# Altium project Ultrasound Smart Probe_Ver2.PrjPcb (part 6 of 9)

## Sheet LVPS FPGA.SchDoc: LVPS FPGA
size 431 x 279 mm; Date: Not shown in title block; ApprovedBy: Not shown in title block; CheckedBy: Not shown in title block; Author: Not shown in title block; CompanyName: Not shown in title block; DrawnBy: Abhishek Vishwa; Engineer: Not shown in title block; Organization: Not shown in title block; Address1: Not shown in title block; Address2: Not shown in title block; Address3: Not shown in title block; Address4: Not shown in title block; DocumentNumber: 1; Revision: Use project parameter SCH_Rev; SheetNumber: 7; SheetTotal: 12; PageSetup: Record=PageOptions|CenterHorizontal=True|CenterVertical=True|PrintScale=1.00|XCorrection=1.00|YCorrection=1.00|PrintKind=0|BorderSize=5000000|LeftOffset=0|BottomOffset=0|Orientation=2|PaperLength=1000|PaperWidth=1000|Scale=100|PaperSource=15|PrintQuality=600|MediaType=1|DitherType=10|PaperKind=Letter|PrintScaleMode=1; CurrentTime: Not shown in title block; CurrentDate: Not shown in title block; Time: Not shown in title block; DocumentFullPathAndName: Not shown in title block; DocumentName: Not shown in title block; ModifiedDate: Not shown in title block; ImagePath: Not shown in title block
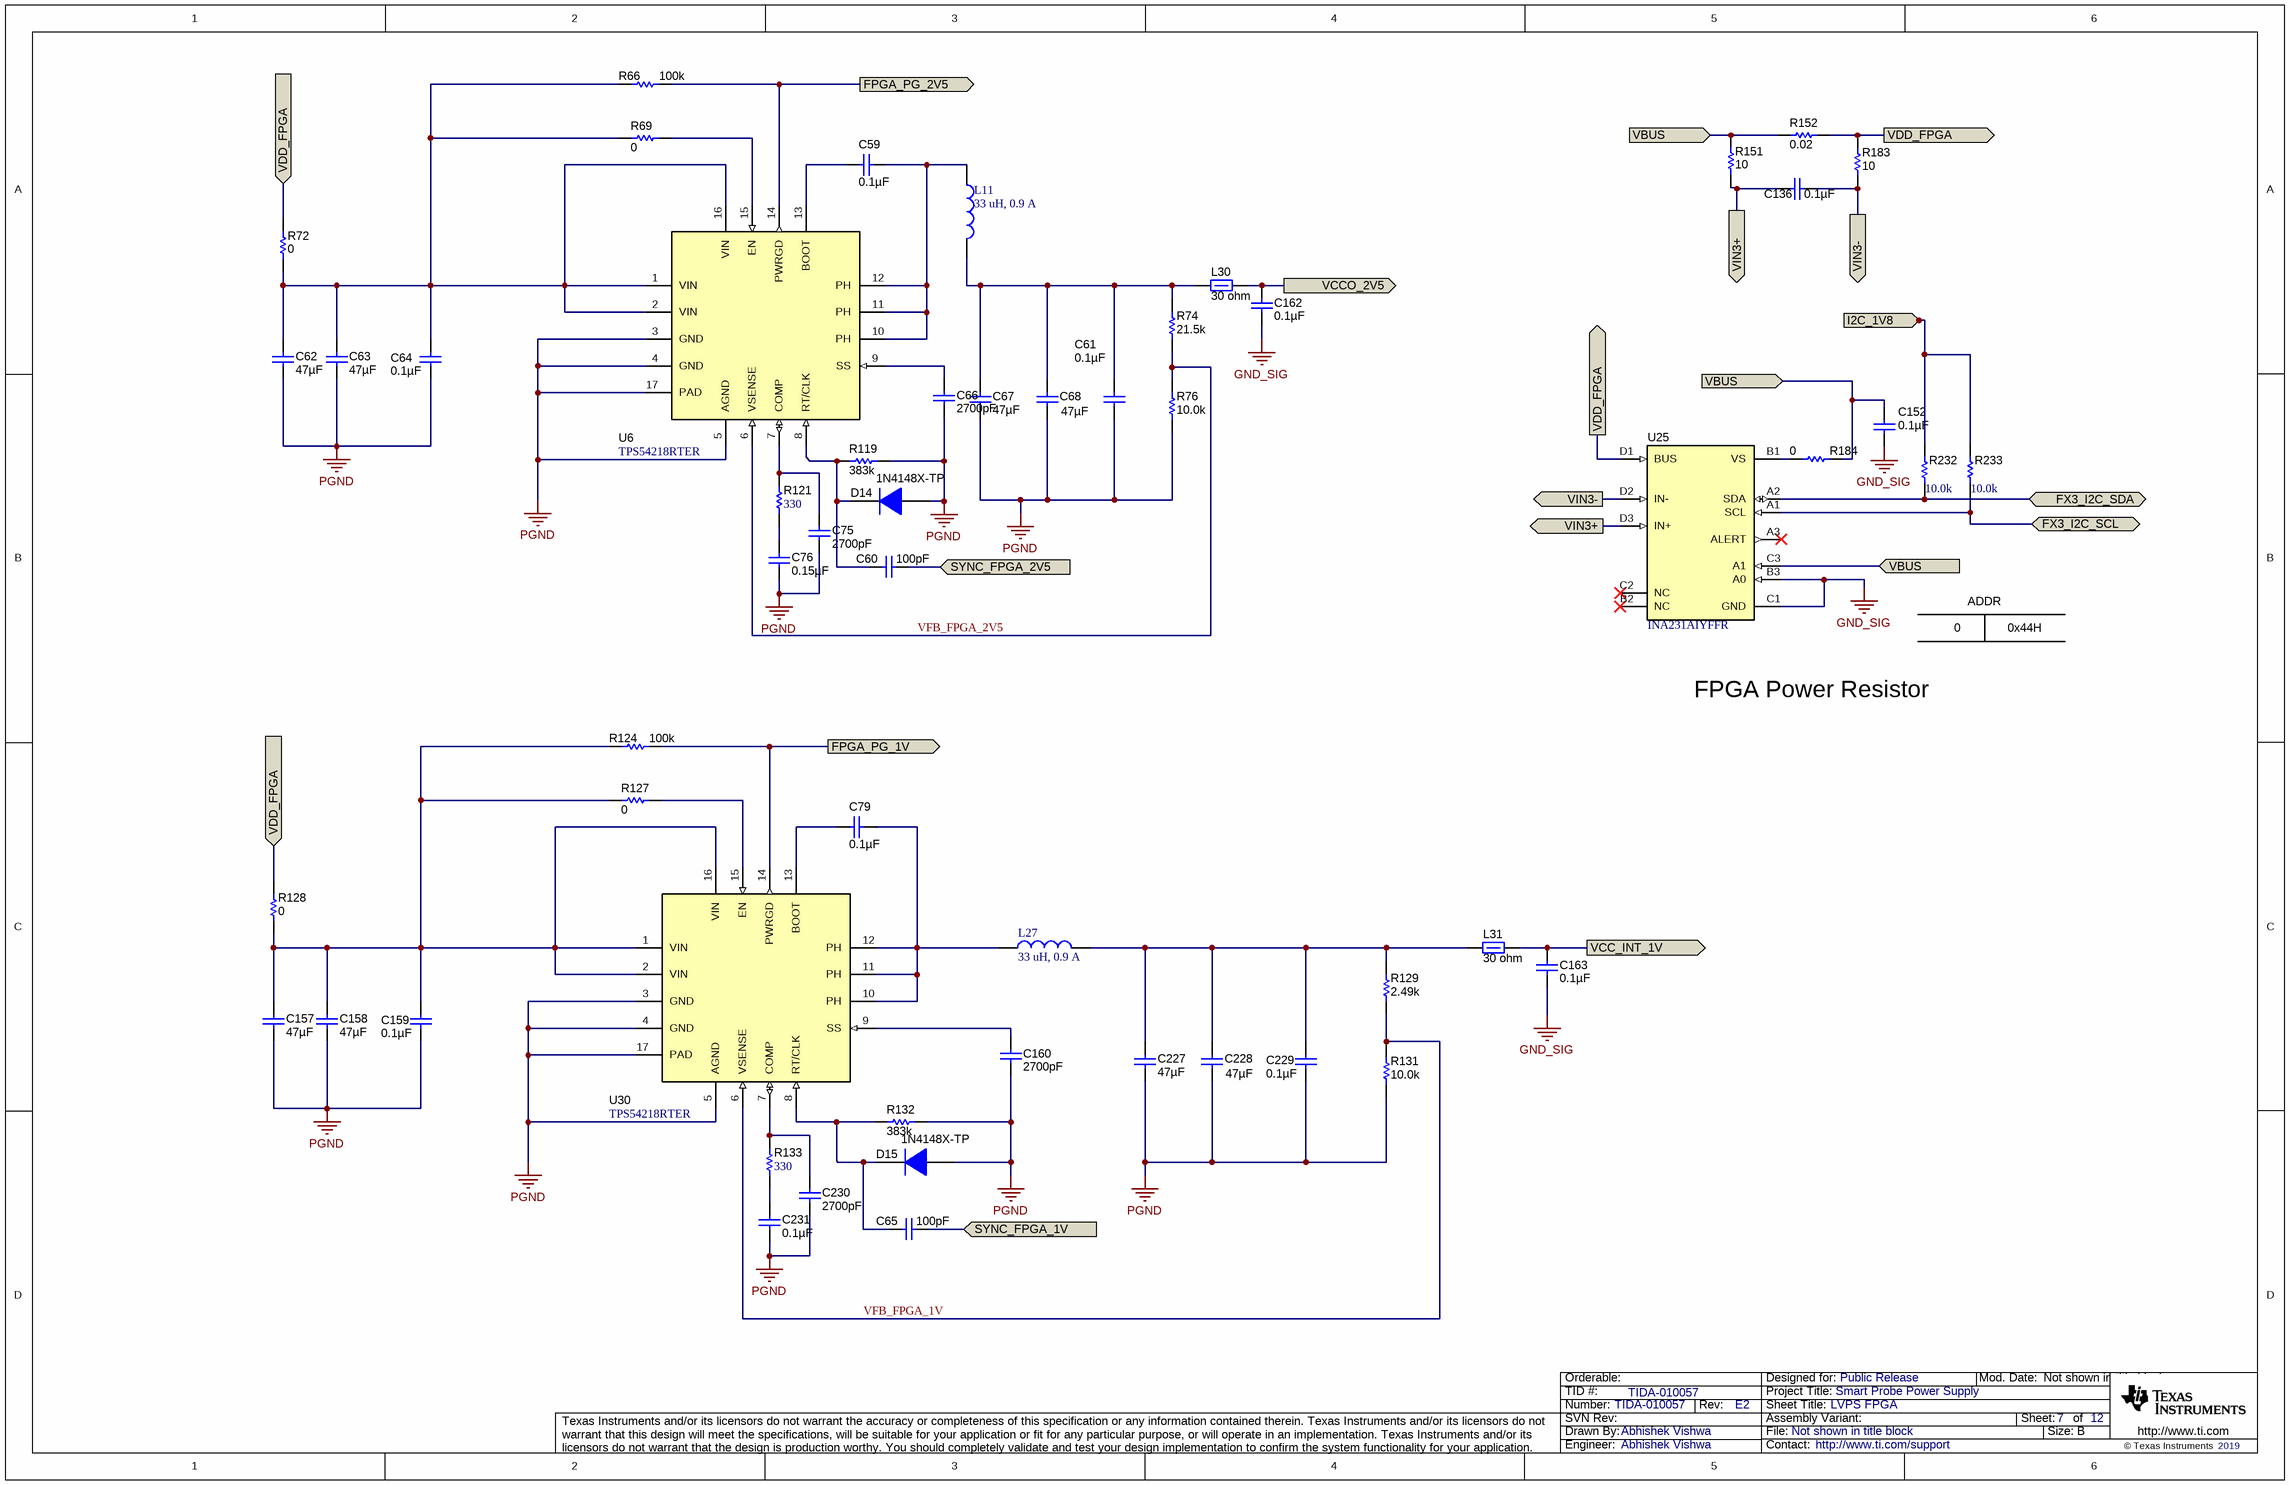
[diagram p6: LVPS FPGA.SchDoc]

### Parts
C59  ValueDisplayed: 0.1µF  [0603]  (hidden comment: 885012206095)
C60  ValueDisplayed: 100pF  [0402]  (hidden comment: CL05C101JB5NNNC)
C61  ValueDisplayed: 0.1µF  [0603]  (hidden comment: 885012206095)
C62  ValueDisplayed: 47µF  [0805_HV]  (hidden comment: GRM219R60J476ME44D)
C63  ValueDisplayed: 47µF  [0805_HV]  (hidden comment: GRM219R60J476ME44D)
C64  ValueDisplayed: 0.1µF  [0603]  (hidden comment: 885012206095)
C65  ValueDisplayed: 100pF  [0402]  (hidden comment: CL05C101JB5NNNC)
C66  ValueDisplayed: 2700pF  [0402]  (hidden comment: CL05B272KB5NNNC)
C67  ValueDisplayed: 47µF  [0603]  (hidden comment: GRM188R60J476ME15D)
C68  ValueDisplayed: 47µF  [0603]  (hidden comment: GRM188R60J476ME15D)
C75  ValueDisplayed: 2700pF  [0402]  (hidden comment: CL05B272KB5NNNC)
C76  ValueDisplayed: 0.15µF  [0402]  (hidden comment: CL05B154KO5NNNC)
C79  ValueDisplayed: 0.1µF  [0603]  (hidden comment: 885012206095)
C136  ValueDisplayed: 0.1µF  [0201_033]  (hidden comment: C0603X6S1C104K030BC)
C152  ValueDisplayed: 0.1µF  [0201_033]  (hidden comment: C0603X6S1C104K030BC)
C157  ValueDisplayed: 47µF  [0805_HV]  (hidden comment: GRM219R60J476ME44D)
C158  ValueDisplayed: 47µF  [0805_HV]  (hidden comment: GRM219R60J476ME44D)
C159  ValueDisplayed: 0.1µF  [0603]  (hidden comment: 885012206095)
C160  ValueDisplayed: 2700pF  [0402]  (hidden comment: CL05B272KB5NNNC)
C162  ValueDisplayed: 0.1µF  [0402]  (hidden comment: GRM155R61E104KA87D)
C163  ValueDisplayed: 0.1µF  [0402]  (hidden comment: GRM155R61E104KA87D)
C227  ValueDisplayed: 47µF  [0603]  (hidden comment: GRM188R60J476ME15D)
C228  ValueDisplayed: 47µF  [0603]  (hidden comment: GRM188R60J476ME15D)
C229  ValueDisplayed: 0.1µF  [0603]  (hidden comment: 885012206095)
C230  ValueDisplayed: 2700pF  [0402]  (hidden comment: CL05B272KB5NNNC)
C231  ValueDisplayed: 0.1µF  [0402]  (hidden comment: GRM155R61E104KA87D)
D14  1N4148X-TP  [SOD-523]
D15  1N4148X-TP  [SOD-523]
L11  33 uH, 0.9 A  [WE-TPC_5828]
L27  33 uH, 0.9 A  [WE-TPC_5828]
L30  ValueDisplayed: 30 ohm  [0603]  (hidden comment: 742792609)
L31  ValueDisplayed: 30 ohm  [0603]  (hidden comment: 742792609)
R66  ValueDisplayed: 100k  [0402]  (hidden comment: CRCW0402100KJNED)
R69  ValueDisplayed: 0  [0402]  (hidden comment: ERJ-2GE0R00X)
R72  ValueDisplayed: 0  [0603]  (hidden comment: RMCF0603ZT0R00)
R74  ValueDisplayed: 21.5k  [0402]  (hidden comment: ERJ-2RKF2152X)
R76  ValueDisplayed: 10.0k  [0402]  (hidden comment: ERA-2AEB103X)
R119  ValueDisplayed: 383k  [0402]  (hidden comment: CRCW0402383KFKED)
R121  ValueDisplayed: 330  [0402]  (hidden comment: CRCW0402160RJNED)
R124  ValueDisplayed: 100k  [0402]  (hidden comment: CRCW0402100KJNED)
R127  ValueDisplayed: 0  [0402]  (hidden comment: ERJ-2GE0R00X)
R128  ValueDisplayed: 0  [0603]  (hidden comment: RMCF0603ZT0R00)
R129  ValueDisplayed: 2.49k  [0402]  (hidden comment: ERJ-2RKF2491X)
R131  ValueDisplayed: 10.0k  [0402]  (hidden comment: ERA-2AEB103X)
R132  ValueDisplayed: 383k  [0402]  (hidden comment: CRCW0402383KFKED)
R133  ValueDisplayed: 330  [0402]  (hidden comment: CRCW0402160RJNED)
R151  ValueDisplayed: 10  [0201]  (hidden comment: RC0201JR-0710RL)
R152  ValueDisplayed: 0.02  [1206]  (hidden comment: CSR1206FK20L0)
R183  ValueDisplayed: 10  [0201]  (hidden comment: RC0201JR-0710RL)
R184  ValueDisplayed: 0  [0201]  (hidden comment: ERJ-1GN0R00C)
R232  ValueDisplayed: 10.0k  [0201]  (hidden comment: RC0201FS-7D10KL)
R233  ValueDisplayed: 10.0k  [0201]  (hidden comment: RC0201FS-7D10KL)
U6  TPS54218RTER  [RTE0016F]
U25  INA231AIYFFR  [YFF0012AKAD]
U30  TPS54218RTER  [RTE0016F]

### Ports
FPGA_PG_1V (out), FPGA_PG_2V5 (out), FX3_I2C_SCL (bidir), FX3_I2C_SDA (bidir), I2C_1V8 (in), SYNC_FPGA_1V (in), SYNC_FPGA_2V5 (in), VBUS (in), VCC_INT_1V (out), VCCO_2V5 (out), VDD_FPGA (in), VDD_FPGA (out), VIN3+ (out), VIN3- (out)

### Nets
GND_SIG: C152.2 C162.1 C163.1 U25.B3(A0) U25.C1(GND)
PGND: C61.2 C62.2 C63.2 C64.2 C66.2 C67.2 C68.2 C75.2 C76.1 C157.2 C158.2 C159.2 C160.2 C227.2 C228.2 C229.2 C230.2 C231.1 D14.2(A) D15.2(A) R76.1 R119.2 R131.1 R132.2 U6.3(GND) U6.4(GND) U6.5(AGND) U6.17(PAD) U30.3(GND) U30.4(GND) U30.5(AGND) U30.17(PAD)
FPGA_PG_1V: R124.2 U30.14(PWRGD) ; port FPGA_PG_1V
FPGA_PG_2V5: R66.2 U6.14(PWRGD) ; port FPGA_PG_2V5
FX3_I2C_SCL: R233.1 U25.A1(SCL) ; port FX3_I2C_SCL
FX3_I2C_SDA: R232.1 U25.A2(SDA) ; port FX3_I2C_SDA
I2C_1V8: R232.2 R233.2 ; port I2C_1V8
SYNC_FPGA_1V: C65.1 ; port SYNC_FPGA_1V
SYNC_FPGA_2V5: C60.1 ; port SYNC_FPGA_2V5
VBUS: C152.1 R151.2 R152.1 R184.2 U25.C3(A1) ; port VBUS
VCC_INT_1V: C163.2 L31.1 ; port VCC_INT_1V
VCCO_2V5: C162.2 L30.1 ; port VCCO_2V5
VDD_FPGA: R72.2 R128.2 R152.2 R183.2 U25.D1(BUS) ; port VDD_FPGA
VFB_FPGA_1V: R129.1 R131.2 U30.6(VSENSE)
VFB_FPGA_2V5: R74.1 R76.2 U6.6(VSENSE)
VIN3+: C136.1 R151.1 U25.D3(IN+) ; port VIN3+
VIN3-: C136.2 R183.1 U25.D2(IN-) ; port VIN3-
NetC59_1: C59.1 U6.13(BOOT)
NetC59_2: C59.2 L11.1 U6.10(PH) U6.11(PH) U6.12(PH)
NetC60_2: C60.2 D14.1(K) R119.1 U6.8(RT/CLK)
NetC61_1: C61.1 C67.1 C68.1 L11.2 L30.2 R74.2
NetC62_1: C62.1 C63.1 C64.1 R66.1 R69.1 R72.1 U6.1(VIN) U6.2(VIN) U6.16(VIN)
NetC65_2: C65.2 D15.1(K) R132.1 U30.8(RT/CLK)
NetC66_1: C66.1 U6.9(SS)
NetC75_1: C75.1 R121.2 U6.7(COMP)
NetC76_2: C76.2 R121.1
NetC79_1: C79.1 U30.13(BOOT)
NetC79_2: C79.2 L27.1 U30.10(PH) U30.11(PH) U30.12(PH)
NetC157_1: C157.1 C158.1 C159.1 R124.1 R127.1 R128.1 U30.1(VIN) U30.2(VIN) U30.16(VIN)
NetC160_1: C160.1 U30.9(SS)
NetC227_1: C227.1 C228.1 C229.1 L27.2 L31.2 R129.2
NetC230_1: C230.1 R133.2 U30.7(COMP)
NetC231_2: C231.2 R133.1
NetR69_2: R69.2 U6.15(EN)
NetR127_2: R127.2 U30.15(EN)
NetR184_1: R184.1 U25.B1(VS)

Not connected (* = marked no-connect by the designer): U25 A3(ALERT)* B2(NC)* C2(NC)*

### Notes on the sheet
- 0
- ADDR
- 0x44H
- FPGA Power Resistor
- Drawn By:
- SVN Rev:
- Number:
- TID #:
- Orderable:
- Rev:
- Sheet Title:
- File:
- Project Title:
- Designed for:
- Assembly Variant:
- Mod. Date:
- Sheet:
- Size:
- of
- B
- http://www.ti.com
- Texas Instruments and/or its licensors do not warrant the accuracy or completeness of this specification or any information contained therein. Texas Instruments and/or its licensors do not warrant that this design will meet the specifications, will be suitable for your application or fit for any particular purpose, or will operate in an implementation. Texas Instruments and/or its licensors do not warrant that the design is production worthy. You should completely validate and test your design implementation to confirm the system functionality for your application.
- Engineer:
- Contact:
- © Texas Instruments

### Library data of the parts
C59 C61 C64 C79 C159 C229 = 885012206095: CAP, CERM, 0.1 µF, 50 V,+/- 10%, X7R, 0603; Manufacturer: Wurth Elektronik; Polarized: N; CompType: Capacitor; Value: 0.1uF; U/M: EA; Cap_F: 0.0000001; Tolerance_%: 10; VDC_V: 50; Value2: 50V; TaMin_C: -55; TaMax_C: 125; SizeArea_mm2: 1.28; SizeAreaWB_mm2: 4.68; SizeX_mm: 1.6; SizeY_mm: 0.8; SizeZ_mm: 1; AEC Category: Q200; Green_Lifecycle: Active; Green_REACh: Passed; SymbolVersion: 2008-07-09; PartNumber: 885012206095; PackageReference: 0603; RoHS: Y; MountType: SMT; Technology: Ceramic; TempCo: X7R; Cap_Case: 0603; Published: 2008-06-19; Publisher: Texas Instruments; LatestRevisionDate: 2017-06-22; ComponentLink1Description: Datasheet link; ComponentLink1URL: http://katalog.we-online.de/pbs/datasheet/885012206095.pdf; AEC Qualified: N; AEC Grade: N/A; Green_EU RoHS: Passed; Green_EU RoHS-2: Incomplete
C60 C65 = 0402YC101KAT2A: CAP CER 100PF 50V C0G/NP0 0402; Manufacturer: Samsung Electro-Mechanics; Polarized: N; CompType: Capacitor; U/M: EA; Cap_F: 0.0000000001; Tolerance_%: 5; VDC_V: 16; Value2: 50; TempCo: X7R; TaMin_C: -55; TaMax_C: 125; SizeArea_mm2: 0.5; SizeAreaWB_mm2: 3; SizeX_mm: 1; SizeZ_mm: 0.6; AEC Category: Q200; SymbolVersion: 2008-07-09; Value: 100pF; PartNumber: CL05C101JB5NNNC; PackageReference: 0402; RoHS: Y; MountType: SMT; Technology: Ceramic; Cap_Case: 0402; SizeY_mm: 0.5; Published: 2008-06-19; Publisher: Texas Instruments; LatestRevisionDate: 2017-06-22; ComponentLink1Description: Datasheet link; ComponentLink1URL: http://datasheets.avx.com/X7RDielectric.pdf; Supplier 1: Digi-Key; Supplier Part Number 1: 1276-1025-1-ND; Supplier 2: Newark; Supplier 3: Mouser; AEC Qualified: N; AEC Grade: N/A
C62 C63 C157 C158 = GRM219R60J476ME44D: CAP, CERM, 47 µF, 6.3 V,+/- 20%, X5R, 0805; Manufacturer: MuRata; Polarized: N; CompType: Capacitor; Value: 47uF; U/M: EA; Cap_F: 0.000047; Tolerance_%: 20; VDC_V: 6.3; Value2: 6.3V; TaMin_C: -55; TaMax_C: 85; Cap_Case: 0805; SizeArea_mm2: 2.5; SizeAreaWB_mm2: 6.75; SizeX_mm: 2; SizeY_mm: 1.25; SizeZ_mm: 1.45; AEC Category: Q200; Green_Lifecycle: Active; Green_REACh: Passed; SymbolVersion: 2008-07-09; PartNumber: GRM219R60J476ME44D; PackageReference: 0805; RoHS: Y; MountType: SMT; Technology: Ceramic; TempCo: X5R; Published: 2008-06-19; Publisher: Texas Instruments; LatestRevisionDate: 2017-06-22; ComponentLink1Description: Datasheet link; ComponentLink1URL: http://psearch.en.murata.com/capacitor/product/GRM219R60J476ME44%23.pdf; Supplier 1: Digi-Key; Supplier Part Number 1: 490-13249-1-ND; Supplier 2: Mouser; Supplier Part Number 2: 81-GRM219R60J476ME4D; AEC Qualified: N; AEC Grade: N/A; Green_EU RoHS: Passed; Green_EU RoHS-2: Incomplete
C66 C75 C160 C230 = GRM155R71H272KA01D: CAP, CERM, 2700 pF, 50 V,+/- 10%, X7R, 0402; Manufacturer: Samsung Electro-Mechanics; Polarized: N; CompType: Capacitor; Value: 2700pF; U/M: EA; Cap_F: 0.0000000027; Tolerance_%: 10; VDC_V: 50; Value2: 50V; TaMin_C: -55; TaMax_C: 125; SizeArea_mm2: 0.5; SizeAreaWB_mm2: 3; SizeX_mm: 1; SizeZ_mm: 0.6; AEC Category: Q200; SymbolVersion: 2008-07-09; PartNumber: CL05B272KB5NNNC; PackageReference: 0402; RoHS: Y; MountType: SMT; Technology: Ceramic; TempCo: X7R; Cap_Case: 0402; SizeY_mm: 0.5; Published: 2008-06-19; Publisher: Texas Instruments; LatestRevisionDate: 2017-06-22; ComponentLink1Description: Datasheet link; ComponentLink1URL: http://search.murata.co.jp/Ceramy/PnsearchViewAction.do?HnOFG=ON&HnNFG=ON&SEL_CNT=50&sLang=en&sKey=GRM155R71H272KA01D&x=9&y=9&search=startwith; Supplier 1: Digi-Key; Supplier Part Number 1: 1276-1268-1-ND; Supplier 2: Mouser; AEC Qualified: ?
C67 C68 C227 C228 = GRM188R60J476ME15D: CAP, CERM, 47 µF, 6.3 V,+/- 20%, X5R, 0603; Manufacturer: MuRata; Polarized: N; CompType: Capacitor; Value: 47uF; U/M: EA; Cap_F: 0.000047; Tolerance_%: 20; VDC_V: 6.3; Value2: 6.3V; TaMin_C: -55; TaMax_C: 85; SizeArea_mm2: 1.28; SizeAreaWB_mm2: 4.68; SizeX_mm: 1.6; SizeY_mm: 0.8; SizeZ_mm: 1; AEC Category: Q200; Green_Lifecycle: Active; Green_REACh: Passed; SymbolVersion: 2008-07-09; PartNumber: GRM188R60J476ME15D; PackageReference: 0603; RoHS: Y; MountType: SMT; Technology: Ceramic; TempCo: X5R; Cap_Case: 0603; Published: 2008-06-19; Publisher: Texas Instruments; LatestRevisionDate: 2017-06-22; ComponentLink1Description: Datasheet link; ComponentLink1URL: http://psearch.en.murata.com/capacitor/product/GRM188R60J476ME15%23.pdf; AEC Qualified: ?; Green_EU RoHS: Passed; Green_EU RoHS-2: Incomplete
C76 = GRM155R61E104KA87D: CAP CER 0.15UF 16V X7R 0402; Manufacturer: Samsung Electro-Mechanics; Polarized: N; CompType: Capacitor; U/M: EA; Cap_F: 0.00000015; Tolerance_%: 10; VDC_V: 25; TempCo: X5R; TaMin_C: -55; TaMax_C: 85; SizeArea_mm2: 0.5; SizeAreaWB_mm2: 3; SizeX_mm: 1; SizeZ_mm: 0.6; Green_Lifecycle: Active; Green_REACh: Passed; SymbolVersion: 2008-07-09; Value: 0.15uF; PartNumber: CL05B154KO5NNNC; PackageReference: 0402; RoHS: Y; Value2: 16V; MountType: SMT; Technology: Ceramic; Cap_Case: 0402; SizeY_mm: 0.5; Published: 2008-06-19; Publisher: Texas Instruments; LatestRevisionDate: 2017-06-22; ComponentLink1Description: Datasheet link; ComponentLink1URL: http://psearch.murata.com/capacitor/product/GRM155R61E104KA87%23.pdf; AEC Qualified: N; AEC Grade: N/A; Green_EU RoHS: Passed; Green_EU RoHS-2: Passed
C136 C152 = C0603X6S1C104K030BC: CAP, CERM, 0.1 µF, 16 V,+/- 10%, X6S, 0201; Manufacturer: TDK; Polarized: N; CompType: Capacitor; Value: 0.1uF; U/M: EA; Cap_F: 0.0000001; Tolerance_%: 10; VDC_V: 16; Value2: 16V; TaMin_C: -55; TaMax_C: 105; Cap_Case: 0201; SizeArea_mm2: 0.18; SizeAreaWB_mm2: 2.08; SizeX_mm: 0.6; SizeY_mm: 0.3; SizeZ_mm: 0.33; AEC Category: Q200; SymbolVersion: 2008-07-09; PartNumber: C0603X6S1C104K030BC; PackageReference: 0201; RoHS: Y; MountType: SMT; Technology: Ceramic; TempCo: X6S; Published: 2008-06-19; Publisher: Texas Instruments; LatestRevisionDate: 2017-06-22; ComponentLink1Description: Datasheet link; ComponentLink1URL: http://product.tdk.com/en/catalog/datasheets/mlcc_commercial_general_en.pdf; Supplier 1: Digi-Key; Supplier Part Number 1: 445-15903-1-ND; Supplier 2: Newark; Supplier Part Number 2: 17X8592; Supplier 3: Mouser; Supplier Part Number 3: 810-C0603X6S1C104KBC; AEC Qualified: N; AEC Grade: N/A
C162 C163 C231 = GRM155R61E104KA87D: CAP, CERM, 0.1 µF, 25 V,+/- 10%, X5R, 0402; Manufacturer: MuRata; Polarized: N; CompType: Capacitor; Value: 0.1uF; U/M: EA; Cap_F: 0.0000001; Tolerance_%: 10; VDC_V: 25; Value2: 25V; TaMin_C: -55; TaMax_C: 85; SizeArea_mm2: 0.5; SizeAreaWB_mm2: 3; SizeX_mm: 1; SizeZ_mm: 0.6; AEC Category: Q200; Green_Lifecycle: Active; Green_REACh: Passed; SymbolVersion: 2008-07-09; PartNumber: GRM155R61E104KA87D; PackageReference: 0402; RoHS: Y; MountType: SMT; Technology: Ceramic; TempCo: X5R; Cap_Case: 0402; SizeY_mm: 0.5; Published: 2008-06-19; Publisher: Texas Instruments; LatestRevisionDate: 2017-06-22; ComponentLink1Description: Datasheet link; ComponentLink1URL: http://psearch.murata.com/capacitor/product/GRM155R61E104KA87%23.pdf; Supplier 1: Digi-Key; Supplier Part Number 1: 490-5920-1-ND; Supplier 2: Mouser; Supplier Part Number 2: 81-GRM155R61E104KA7D; AEC Qualified: N; AEC Grade: N/A; Green_EU RoHS: Passed; Green_EU RoHS-2: Passed
D14 D15 = 1N4148X-TP: Diode, Switching, 75 V, 0.3 A, SOD-523; Manufacturer: Micro Commercial Components; U/M: EA; Vf_V: 1.25; Value: 75V; Value1: 0.3A; Value2: 1.25V; Io_A: 0.3; Vr_V: 75; TJmax_C: 150; SizeAreaWB_mm2: 5.13; SizeArea_mm2: 1.53; SizeX_mm: 1.7; SizeY_mm: 0.9; SizeZ_mm: 0.65; AEC Category: Q101; Green_Lifecycle: Not Set; Green_REACh: Incomplete; SymbolVersion: 2008-12-08; PartNumber: 1N4148X-TP; PackageReference: SOD-523; CompType: Diode; MountType: SMT; Type: Switching; RoHS: Y; Published: 2008-06-26; Publisher: Texas Instruments; LatestRevisionDate: 2017-06-26; ComponentLink1Description: Datasheet link; ComponentLink1URL: http://www.mccsemi.com/up_pdf/1N4148X(SOD-523).PDF; Supplier 1: Digi-Key; Supplier Part Number 1: 1N4148XTPMSCT-ND; Supplier 2: Newark; Supplier Part Number 2: 69R6666; Supplier 3: Mouser; Supplier Part Number 3: 833-1N4148X-TP; AEC Qualified: ?; Green_EU RoHS: Incomplete; Green_EU RoHS-2: Incomplete
L11 L27 = 744053330: SMT Shielded Tiny Power Inductor WE-TPC, size 5828, 33 uH, 0.9 A; Rated Current: 0.9 A; Inductance: 33 uH; DC Resistance max.: 190 mOhm; Self Resonant Frequency: 15 MHz; Saturation Current: 0.75 A; ComponentLink1Description: Manufacturer; ComponentLink1URL: http://www.we-online.de; ComponentLink2Description: Datasheet; ComponentLink2URL: https://katalog.we-online.com/pbs/datasheet/744053330.pdf; Part Number: 744053330; Published Date: December 2018; Publisher: Wurth Elektronik; Size: 5828; Operating Temperature: -40 to +125 degC; Mounting Technology: SMT; Packaging: Tape and Reel
L30 L31 = 742792609: Ferrite Bead, 30 ohm @ 100 MHz, 3 A, 0603; Manufacturer: Wurth Elektronik; Value: 30 ohm; Imax_A: 3; DCR_ohm: 0.04; Value1: 0.04 ohm; Value2: 3A; SizeAreaWB_mm2: 4.68; SizeArea_mm2: 1.28; SizeX_mm: 1.6; SizeY_mm: 0.8; SizeZ_mm: 1; ZTyp@100MHz_Ohm: 30; Ztyp@1GHz_Ohm: 40.472; Green_Lifecycle: Active; Green_REACh: Passed; SymbolVersion: 2017-01-06; PartNumber: 742792609; CompType: Ferrite Bead; MountType: SMT; PackageReference: 0603; Published: 2014-04-30; Publisher: Texas Instruments; LatestRevisionDate: 2017-06-22; ComponentLink1Description: Datasheet link; ComponentLink1URL: http://katalog.we-online.de/pbs/datasheet/742792609.pdf; RoHS: Y; Supplier 1: Digi-Key; Supplier Part Number 1: 732-1591-1-ND; Supplier 2: Mouser; Supplier Part Number 2: 710-742792609; Green_EU RoHS: Passed; Green_EU RoHS-2: Incomplete
R66 R124 = CRCW0402100KJNED: RES, 100 k, 5%, 0.063 W, 0402; Manufacturer: Vishay-Dale; CompType: Resistor; Value: 100k; Res_ohm: 100000; Tolerance_%: 5; Power_W: 0.063; Value2: 0.063W; VDC_V: 50; TempCo: 200 ppm/C; SizeArea_mm2: 0.5; SizeX_mm: 1; SizeZ_mm: 0.6; EIA_Code: E24; U/M: EA; AEC Category: Q200; Green_Lifecycle: Active; Green_REACh: Passed; SymbolVersion: 2009-05-29; PartNumber: CRCW0402100KJNED; PackageReference: 0402; RoHS: Y; Value_Code: 100k; Value1: 5%; MountType: SMT; Technology: Thick Film; SizeY_mm: 0.5; Published: 2008-06-26; Publisher: Texas Instruments; LatestRevisionDate: 2017-06-12; ComponentLink1Description: Datasheet link; ComponentLink1URL: http://www.vishay.com/docs/20035/dcrcwe3.pdf; Supplier 1: Digi-Key; Supplier Part Number 1: 541-100KJCT-ND; Supplier 2: Newark; Supplier Part Number 2: 59M6699; Supplier 3: Mouser; Supplier Part Number 3: 71-CRCW0402J-100K-E3; AEC Qualified: ?; Green_EU RoHS: Passed with Exemption; Green_EU RoHS-2: Passed
R69 R127 = ERJ-2GE0R00X: RES, 0, 5%, 0.063 W, 0402; Manufacturer: Panasonic; CompType: Resistor; Value: 0; Value_Code: 0000; Tolerance_%: 5; Power_W: 0.063; Value2: 0.063W; VDC_V: 50; TempCo: 600 ppm/C; SizeArea_mm2: 0.5; SizeX_mm: 1; SizeZ_mm: 0.6; EIA_Code: E24; U/M: EA; AEC Category: Q200; Green_Lifecycle: Active; Green_REACh: Passed; SymbolVersion: 2009-05-29; PartNumber: ERJ-2GE0R00X; PackageReference: 0402; RoHS: Y; Res_ohm: 0; Value1: 5%; MountType: SMT; Technology: Thick Film; SizeY_mm: 0.5; Published: 2008-06-26; Publisher: Texas Instruments; LatestRevisionDate: 2017-06-12; ComponentLink1Description: Datasheet link; ComponentLink1URL: http://www.panasonic.com/industrial/components/pdf/AOA0000CE1.pdf; Supplier 1: Digi-Key; Supplier Part Number 1: P0.0JCT-ND; Supplier 2: Newark; Supplier Part Number 2: 65T8307; Supplier 3: Mouser; Supplier Part Number 3: 667-ERJ-2GE0R00X; AEC Qualified: ?; Green_EU RoHS: Passed with Exemption; Green_EU RoHS-2: Passed
R72 R128 = RMCF0603ZT0R00: RES, 0, 1%, 0.1 W, AEC-Q200 Grade 0, 0603; Manufacturer: Stackpole Electronics Inc; CompType: Resistor; Value: 0; Tolerance_%: 1; Power_W: 0.1; Value2: 0.1W; TempCo: ppm/C; SizeArea_mm2: 1.28; SizeX_mm: 1.6; SizeY_mm: 0.8; U/M: EA; AEC Category: Q200; AEC Qualified: Y; Green_Lifecycle: Active; Green_REACh: Passed; SymbolVersion: 2009-05-29; PartNumber: RMCF0603ZT0R00; PackageReference: 0603; RoHS: Y; Res_ohm: 0; Value_Code: 0; Value1: 1%; MountType: SMT; Technology: Thick Film; SizeZ_mm: 1; Published: 2008-06-26; Publisher: Texas Instruments; LatestRevisionDate: 2017-06-13; ComponentLink1Description: Datasheet link; ComponentLink1URL: https://www.seielect.com/Catalog/SEI-RMCF_RMCP.pdf; Supplier 1: Digi-Key; Supplier Part Number 1: RMCF0603ZT0R00CT-ND; AEC Grade: 0; Green_EU RoHS: Passed with Exemption; Green_EU RoHS-2: Incomplete
R74 = ERJ-2RKF4991X: RES SMD 21.5K OHM 1% 1/10W 0402; Manufacturer: Panasonic; CompType: Resistor; Res_ohm: 4990; Tolerance_%: 1; Power_W: 0.1; Value2: 0.1W; VDC_V: 50; TempCo: 100 ppm/C; SizeArea_mm2: 0.5; SizeZ_mm: 0.6; EIA_Code: E96; U/M: EA; AEC Qualified: Y; AEC Grade: 0; Green_Lifecycle: Active; Green_REACh: Passed; SymbolVersion: 2009-05-29; Value: 21.5k; PartNumber: ERJ-2RKF2152X; PackageReference: 0402; RoHS: Y; Value1: 1%; MountType: SMT; Technology: Thick Film; SizeX_mm: 1; SizeY_mm: 0.5; Published: 2008-06-26; Publisher: Texas Instruments; LatestRevisionDate: 2017-06-12; ComponentLink1Description: Datasheet link; ComponentLink1URL: http://industrial.panasonic.com/cdbs/www-data/pdf/RDA0000/AOA0000C86.pdf; Green_EU RoHS-2: Passed
R76 R131 = RK73H1ETTP1002F: RES SMD 10K OHM 0.1% 1/16W 0402; Manufacturer: Panasonic Electronic Components; CompType: Resistor; Value: 10.0k; Res_ohm: 10000; Value_Code: 10k0; Tolerance_%: 1; Power_W: 0.063; Value2: 0.063W; VDC_V: 50; TempCo: 100 ppm/C; SizeArea_mm2: 0.5; SizeZ_mm: 0.6; EIA_Code: E96; U/M: EA; AEC Category: Q200; AEC Qualified: Y; AEC Grade: 0; SymbolVersion: 2009-05-29; PartNumber: ERA-2AEB103X; PackageReference: 0402; RoHS: Y; Value1: 0.1%; MountType: SMT; Technology: Thick Film; SizeX_mm: 1; SizeY_mm: 0.5; Published: 2008-06-26; Publisher: Texas Instruments; LatestRevisionDate: 2017-06-12; ComponentLink1Description: Datasheet link; ComponentLink1URL: http://www.koaspeer.com/catimages/Products/RK73H/RK73H.pdf; Supplier 1: Mouser; Supplier Part Number 1: P10KDCCT-ND
R119 R132 = CRCW0402383KFKED: RES, 383 k, 1%, 0.063 W, 0402; Manufacturer: Vishay-Dale; CompType: Resistor; Value: 383k; Res_ohm: 383000; Tolerance_%: 1; Power_W: 0.063; Value2: 0.063W; VDC_V: 50; TempCo: 100 ppm/C; SizeArea_mm2: 0.5; SizeZ_mm: 0.6; EIA_Code: E96; U/M: EA; AEC Category: Q200; Green_Lifecycle: Active; Green_REACh: Passed; SymbolVersion: 2009-05-29; PartNumber: CRCW0402383KFKED; PackageReference: 0402; RoHS: Y; Value_Code: 383k; Value1: 1%; MountType: SMT; Technology: Thick Film; SizeX_mm: 1; SizeY_mm: 0.5; Published: 2008-06-26; Publisher: Texas Instruments; LatestRevisionDate: 2017-06-12; ComponentLink1Description: Datasheet link; ComponentLink1URL: http://www.vishay.com/docs/20035/dcrcwe3.pdf; Supplier 1: Digi-Key; Supplier Part Number 1: 541-383KLCT-ND; Supplier 2: Newark; Supplier Part Number 2: 52K7024; Supplier 3: Mouser; Supplier Part Number 3: 71-CRCW0402-383K-E3; AEC Qualified: ?; Green_EU RoHS: Passed with Exemption; Green_EU RoHS-2: Passed
R121 R133 = CMP-0026845-3: RES SMD 330 OHM 1% 1/10W 0402; Manufacturer: Panasonic Electronic Components; PartNumber: ERJ-2RKF3300X; Power_W: 63mW; TempCo: 200 ppm/C; Value_Code: 160R; Value1: 5%; Value: 160; EIA_Code: E24; SizeX_mm: 1; SizeY_mm: 0.5; SizeZ_mm: 0.6; Value2: 0.063W; AEC Qualified: Y; VDC_V: 50V; AEC Category: Q200; AEC Grade: 0; RoHS: E; MountType: SMT; PackageReference: 0402; Tolerance_%: 1%; Res_ohm: 160; SizeArea_mm2: 0.5; CompType: Resistor; ComponentLink1Description: Datasheet link; Technology: Thick Film; ComponentLink1URL: http://www.vishay.com/docs/20035/dcrcwe3.pdf
R129 = ERJ-2RKF4991X: RES SMD 2.49K OHM 1% 1/10W 0402; Manufacturer: Panasonic; CompType: Resistor; Res_ohm: 4990; Tolerance_%: 1; Power_W: 0.1; Value2: 0.1W; VDC_V: 50; TempCo: 100 ppm/C; SizeArea_mm2: 0.5; SizeZ_mm: 0.6; EIA_Code: E96; U/M: EA; AEC Qualified: Y; AEC Grade: 0; Green_Lifecycle: Active; Green_REACh: Passed; SymbolVersion: 2009-05-29; Value: 2.49k; PartNumber: ERJ-2RKF2491X; PackageReference: 0402; RoHS: Y; Value1: 1%; MountType: SMT; Technology: Thick Film; SizeX_mm: 1; SizeY_mm: 0.5; Published: 2008-06-26; Publisher: Texas Instruments; LatestRevisionDate: 2017-06-12; ComponentLink1Description: Datasheet link; ComponentLink1URL: http://industrial.panasonic.com/cdbs/www-data/pdf/RDA0000/AOA0000C86.pdf; Green_EU RoHS-2: Passed
R151 R183 = RC0201JR-0710RL: RES, 10, 5%, 0.05 W, 0201; Manufacturer: Yageo America; CompType: Resistor; Value: 10; Value_Code: 10R0; Tolerance_%: 5; Power_W: 0.05; Value2: 0.05W; VDC_V: 25; TempCo: 350 ppm/C; SizeArea_mm2: 0.18; SizeX_mm: 0.6; SizeY_mm: 0.3; SizeZ_mm: 0.26; EIA_Code: E24; U/M: EA; AEC Category: Q200; AEC Qualified: N; SymbolVersion: 2009-05-29; PartNumber: RC0201JR-0710RL; PackageReference: 0201; RoHS: Y; Res_ohm: 10; Value1: 5%; MountType: SMT; Technology: Thick Film; Published: 2016-10-14; Publisher: Texas Instruments; LatestRevisionDate: 2017-04-07; ComponentLink1Description: Datasheet link; ComponentLink1URL: http://www.yageo.com/documents/recent/PYu-RC_Group_51_RoHS_L_5.pdf; Supplier 1: Digi-Key; Supplier Part Number 1: 311-10NCT-ND; Supplier 2: Mouser; Supplier Part Number 2: 603-RC0201JR-0710RL; AEC Grade: N/A
R152 = CSR1206FK20L0: RES, 0.02, 1%, 0.5 W, 1206; Manufacturer: Stackpole Electronics Inc; CompType: Resistor; Value: 0.02; Value_Code: R020; Tolerance_%: 1; Power_W: 0.5; Value2: 0.5W; TempCo: 100 ppm/C; SizeArea_mm2: 5.12; SizeX_mm: 3.2; SizeY_mm: 1.6; SizeZ_mm: 1.35; EIA_Code: E96; U/M: EA; AEC Category: Q200; SymbolVersion: 2009-05-29; PartNumber: CSR1206FK20L0; PackageReference: 1206; RoHS: Y; Res_ohm: 0.02; Value1: 1%; MountType: SMT; Technology: Thick Film; Published: 2008-06-26; Publisher: Texas Instruments; LatestRevisionDate: 2017-06-12; ComponentLink1Description: Datasheet link; ComponentLink1URL: http://www.seielect.com/Catalog/SEI-csr.pdf; Supplier 1: Digi-Key; Supplier Part Number 1: CSR1206FK20L0CT-ND; AEC Qualified: ?
R184 = ERJ-1GN0R00C: RES, 0, 5%, 0.05 W, AEC-Q200 Grade 0, 0201; Manufacturer: Panasonic; CompType: Resistor; Value: 0; Value_Code: 0000; Tolerance_%: 5; Power_W: 0.05; Value2: 0.05W; TempCo: ppm/C; SizeArea_mm2: 0.18; SizeX_mm: 0.6; SizeY_mm: 0.3; SizeZ_mm: 0.26; EIA_Code: E24; U/M: EA; AEC Category: Q200; AEC Qualified: Y; SymbolVersion: 2009-05-29; PartNumber: ERJ-1GN0R00C; PackageReference: 0201; RoHS: Y; Res_ohm: 0; Value1: 5%; MountType: SMT; Technology: Thick Film; Published: 2016-10-14; Publisher: Texas Instruments; LatestRevisionDate: 2017-04-07; ComponentLink1Description: Datasheet link; ComponentLink1URL: https://industrial.panasonic.com/cdbs/www-data/pdf/RDA0000/AOA0000C281.pdf; Supplier 1: Digi-Key; Supplier Part Number 1: P15979CT-ND; Supplier 2: Newark; Supplier Part Number 2: 51W5934; Supplier 3: Mouser; Supplier Part Number 3: 667-ERJ-1GN0R00C; AEC Grade: 0
R232 R233 = CMP-0028071-1: RES SMD 10K OHM 1% 1/20W 0201; Manufacturer: Samsung Electro-Mechanics; PartNumber: RC0603F103CS; Power_W: 50mW; TempCo: 200 ppm/C; Value_Code: 10k0; U/M: EA; Value: 10.0k; EIA_Code: E96; SizeX_mm: 0.6; SizeY_mm: 0.3; SizeZ_mm: 0.26; Value2: 0.05W; SizeArea_mm2: 0.18; AEC Qualified: N; VDC_V: 25V; AEC Category: Q200; ComponentLink1URL: http://www.yageo.com/documents/recent/PYu-RC_Group_51_RoHS_L_5.pdf; Publisher: Texas Instruments; Published: 2016-10-14; RoHS: Y; Value1: 1%; MountType: SMT; Supplier 1: Digi-Key; PackageReference: 0201; Tolerance_%: 1%; Res_ohm: 10k; CompType: Resistor; LatestRevisionDate: 2017-03-09; ComponentLink1Description: Datasheet link; AEC Grade: N/A; Supplier Part Number 1: 1276-3670-1-ND; Technology: Thick Film
U6 U30 = CMP-0073970-1: 2.95V to 6V Input, 2A Synchronous Step-Down SWIFT(TM) Converter, RTE0016F (WQFN-16); Alternate PartNumber: TPS54218RTET; Alternate Manufacturer: Texas Instruments; Green_Lifecycle: Active; SizeAreaWB_mm2: 16.0; Green_REACh: Passed; U/M: EA; SizeZ_mm: 0.8; SizeX_mm: 3.0; SizeArea_mm2: 9.0; CompType: IC; ComponentLink1URL: http://www.ti.com/lit/ds/symlink/tps54218.pdf; Publisher: Texas Instruments; PackageDescription: WQFN-16; RoHS: Y; Footprint Path 6: C:\AltiumLibraries\Footprints\TI\.PcbLib; MountType: SMT; Green_EU RoHS-2: Passed; Manufacturer: Texas Instruments; Green_EU RoHS: Passed; PackageReference: RTE0016F; SizeY_mm: 3.0; LatestRevisionDate: 2017-06-09; PartNumber: TPS54218RTER; ComponentLink1Description: Datasheet Link
U25 = CMP-0065450-1: 28-V, Bi-Directional, Zero-Drift, Low-/High-Side, I2C Out Current/Power Monitor w/ Alert in WCSP, YFF0012AKAD (DSBGA-12); Alternate PartNumber: INA231AIYFFT; Alternate Manufacturer: Texas Instruments; Green_Lifecycle: Active; SizeAreaWB_mm2: 6.313872; Green_REACh: Passed; U/M: EA; SizeZ_mm: 0.625; SizeX_mm: 1.388; SizeY_mm: 1.644; SizeArea_mm2: 2.281872; CompType: IC; ComponentLink1URL: http://www.ti.com/lit/ds/symlink/ina231.pdf; Publisher: Texas Instruments; PackageDescription: DSBGA-12; RoHS: Y; Footprint Path 6: C:\AltiumLibraries\Footprints\TI\.PcbLib; MountType: SMT; Green_EU RoHS-2: Passed; Manufacturer: Texas Instruments; Green_EU RoHS: Passed; PackageReference: YFF0012AKAD; LatestRevisionDate: 2017-06-09; PartNumber: INA231AIYFFR; ComponentLink1Description: Datasheet Link